# EAGLE design prog-E01 (EAGLE 7.3.0)
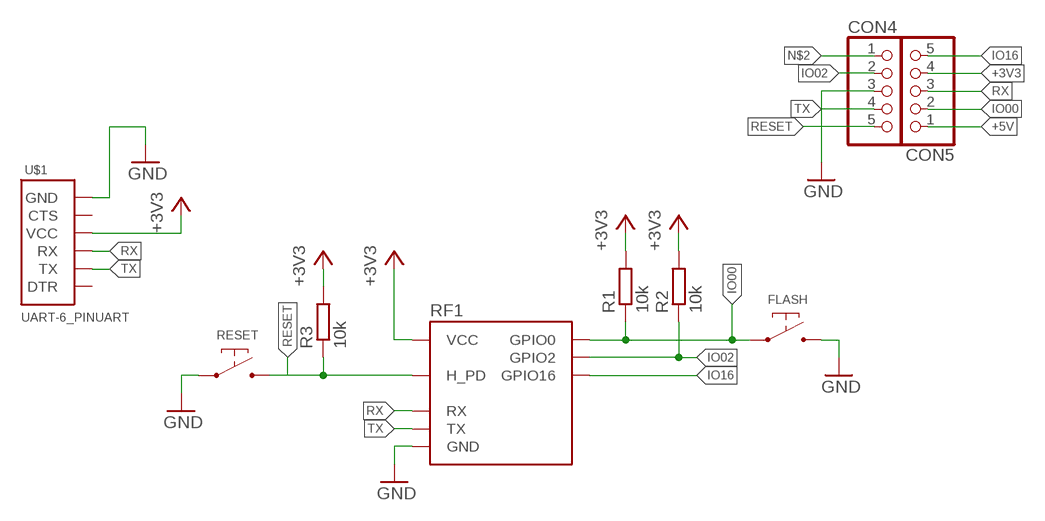
[diagram p0: schematic, sheet 1]

## Parts
CON4  GENERIC-1X5  [PINHEADER-100MIL-1X5-NOSILK]
CON5  GENERIC-1X5  [PINHEADER-100MIL-1X5-NOSILK]
FLASH  SWITCH-DEFAULT_OFF-SMD-2_PIN  [SWITCH-SMD-2_PIN-DX]
R1  10k  R-EU_R0603  [R0603]
R2  10k  R-EU_R0603  [R0603]
R3  10k  R-EU_R0603  [R0603]
RESET  SWITCH-DEFAULT_OFF-SMD-2_PIN  [SWITCH-SMD-2_PIN-DX]
RF1  ESP2866-ESP-01THT-NOSILK  [ESP8266-ESP-01-NOSILK]
U$1  UART-6_PINUART  [ANGLE-1X6]

## Nets
+3V3: CON5.4 R1.2 R2.2 R3.2 RF1.VCC U$1.3(VCC)
+5V: CON5.1
GND: CON4.3 FLASH.P$2 RESET.P$1 RF1.GND U$1.1(GND)
IO00: CON5.2 FLASH.P$1 R1.1 RF1.GPIO0
IO02: CON4.2 R2.1 RF1.GPIO2
IO16: CON5.5 RF1.GPIO16
N$2: CON4.1
RESET: CON4.5 R3.1 RESET.P$2 RF1.H_PD
RX: CON5.3 RF1.RX U$1.4(RX)
TX: CON4.4 RF1.TX U$1.5(TX)
Unconnected: U$1.2(CTS) U$1.6(DTR)

## Library data of the parts
CON4 CON5 = p.peter-connectors:GENERIC-1X5
FLASH RESET = p.peter-passives:SWITCH-DEFAULT_OFF
R1-R3 = p.peter-rcl:R-EU_: RESISTOR, European symbol
RF1 = p.peter-periphery:ESP2866-ESP-01
U$1 = p.peter-connectors:UART-6_PIN: RX and TX direction as seen from outside. I.e. connect RX from connector to RX from Atmega

## Board
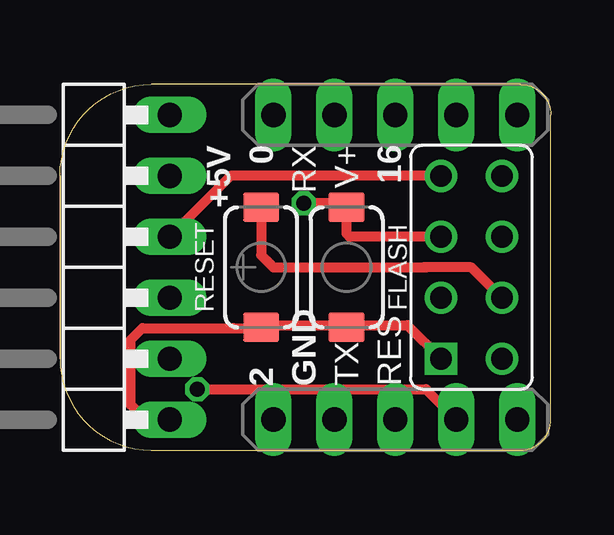
[diagram p1: board, top side]
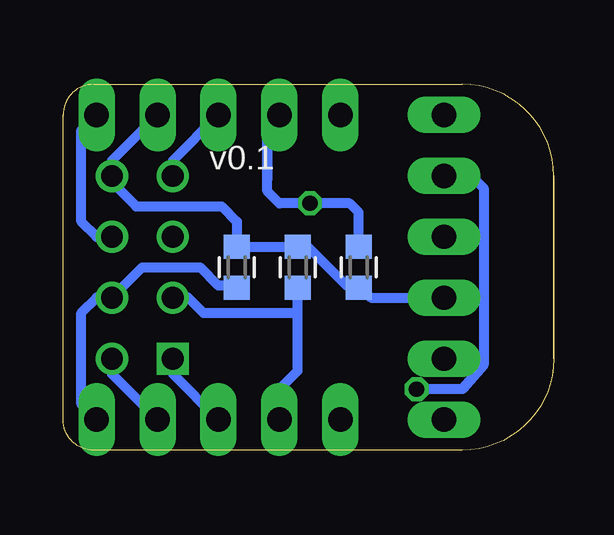
[diagram p2: board, bottom side, seen from below]

Size 20.45 x 15.24 mm. Coordinates in mm from the lower left corner, seen from the top.
Outline: 0,3.81 0,7.62 0,11.43
Outline: 0,11.43 arc-90 3.81,15.24 19.18,15.24 arc-90 20.45,13.97 20.45,1.27 arc-90 19.18,0 3.81,0 arc-90 0,3.81
Outline: 0,11.43 0,3.81
Copper layers (1*16): Top 0.0356mm / dielectric 1.5011mm / Bottom 0.0356mm
Design rules "oshpark": minimum track width 6mil, minimum drill 13mil, track to track 6mil, track to pad 6mil, pad to pad 6mil, via to via 6mil, smd to smd 6mil, copper to edge 15mil, drill to drill 6mil, minimum pad ring 7mil, minimum via ring 7mil, stop-mask expansion 4mil, vias tented up to drill 4.1mm, thermal gap 10mil

### Footprints (pad centres in the part's own frame; a part is rotated, then mirrored left to right if it is on the bottom)
PINHEADER-100MIL-1X5-NOSILK = drill 1.016 long: 1 -5.08,0; 2 -2.54,0; 3 0,0; 4 2.54,0; 5 5.08,0
SWITCH-SMD-2_PIN-DX = smd 1.2 x 1.5: P$1 -2.5,0; P$2 2.5,0
R0603 = smd 1 x 1.1: 1 -0.85,0; 2 0.85,0
ESP8266-ESP-01-NOSILK = drill 0.9 square: GND 1.27,3.81 | drill 0.9: GPIO0 1.27,-1.27; GPIO2 1.27,1.27; GPIO16 -1.27,-1.27; H_PD -1.27,1.27; RX 1.27,-3.81; TX -1.27,3.81; VCC -1.27,-3.81
ANGLE-1X6 = drill 1.016 long: 1 -6.35,-2.54; 2 -3.81,-2.54; 3 -1.27,-2.54; 4 1.27,-2.54; 5 3.81,-2.54; 6 6.35,-2.54

### Placement (x,y rotation side)
CON4  13.97,1.27 0 top
CON5  13.97,13.97 0 top
FLASH  11.94,7.62 270 top
R1  8.13,7.62 270 bottom
R2  10.67,7.62 90 bottom
R3  13.21,7.62 90 bottom
RESET  8.38,7.62 90 top
RF1  17.14,7.62 180 top
U$1  2.03,7.62 90 top

### Tracks (layer width: path | path; a pad name or v marks a point on that pad's centre or on a via)
+3V3
  Bottom 0.406: CON5.4 18.41,12.06 RF1.VCC 18.41,11.18 17.4,10.16 13.84,10.16 13.21,9.53 R3.2 13.21,8.51 13.17,8.47 R2.2 10.63,8.51 10.54,8.51 10.29,8.51 8.64,6.86 8.22,6.86 R1.2 8.13,6.6 7.87,6.6 7.62,6.35 U$1.3
GND
  Top 0.406: RESET.P$1 8.47,5.25 8.51,5.21 11.9,5.21 FLASH.P$2 12.03,5.25 12.06,5.21 14.48,5.21 RF1.GND | RESET.P$1 8.17,5.25 8,5.08 8,4.95 8,5.21 | U$1.1 3.56,1.27 2.92,1.91 2.92,4.57 3.43,5.08 7.24,5.08 8.34,5.08 arc90 RESET.P$1
  Bottom 0.406: RF1.GND 15.88,3.17 CON4.3
IO00  (via drill 0.64)
  Top 0.406: RF1.GPIO0 15.75,8.89 12.06,8.89 11.94,9.02 FLASH.P$1 11.94,10.41 11.81,10.29 | 11.81,10.29 11.75,10.22 11.68,10.16 11.81,10.29 | 11.81,10.29 v10.16,10.29
  Bottom 0.406: R1.1 8.13,8.76 8.13,9.91 8.51,10.29 v10.16,10.29 11.43,10.29 11.94,10.79 11.94,11.3 | 11.94,11.3 11.94,11.56 | 11.94,12.45 11.94,11.3 | 11.94,11.3 11.94,13.46 CON5.2
IO02
  Bottom 0.406: RF1.GPIO2 15.24,6.35 14.61,5.71 10.67,5.71 | CON4.2 11.43,1.91 11.43,2.54 10.67,3.3 10.67,5.71 | 10.67,5.71 R2.1
IO16
  Bottom 0.406: RF1.GPIO16 19.05,8.89 19.68,9.53 19.68,13.34 CON5.5
RESET
  Top 0.406: RF1.H_PD 17.14,7.62 15.24,7.62 | 15.24,7.62 15.11,7.62 | RESET.P$2 8.38,8.13 8.64,7.87 8.76,7.75 8.89,7.62 15.24,7.62
  Bottom 0.406: CON4.5 19.68,1.91 19.68,5.71 19.05,6.35 RF1.H_PD 17.14,7.62 14.73,7.62 13.97,6.86 13.59,6.86 13.5,6.77 R3.1
RX
  Top 0.406: RF1.RX 7.11,11.43 U$1.4
  Bottom 0.406: CON5.3 15.88,12.06 RF1.RX
TX  (via drill 0.64)
  Top 0.406: v5.71,2.54 15.24,2.54 CON4.4
  Bottom 0.406: RF1.TX 18.41,3.17 CON4.4 | U$1.5 4.32,11.43 3.43,11.43 2.92,10.92 2.92,3.81 2.92,3.56 3.81,2.54 4.32,2.54 v5.71,2.54

### Text on the board
tPlace: +5V | 0 | RX | V+ | 16 | 2 | GND | TX | RES
bPlace: v0.1